# EAGLE schematic board (EAGLE 6.4)
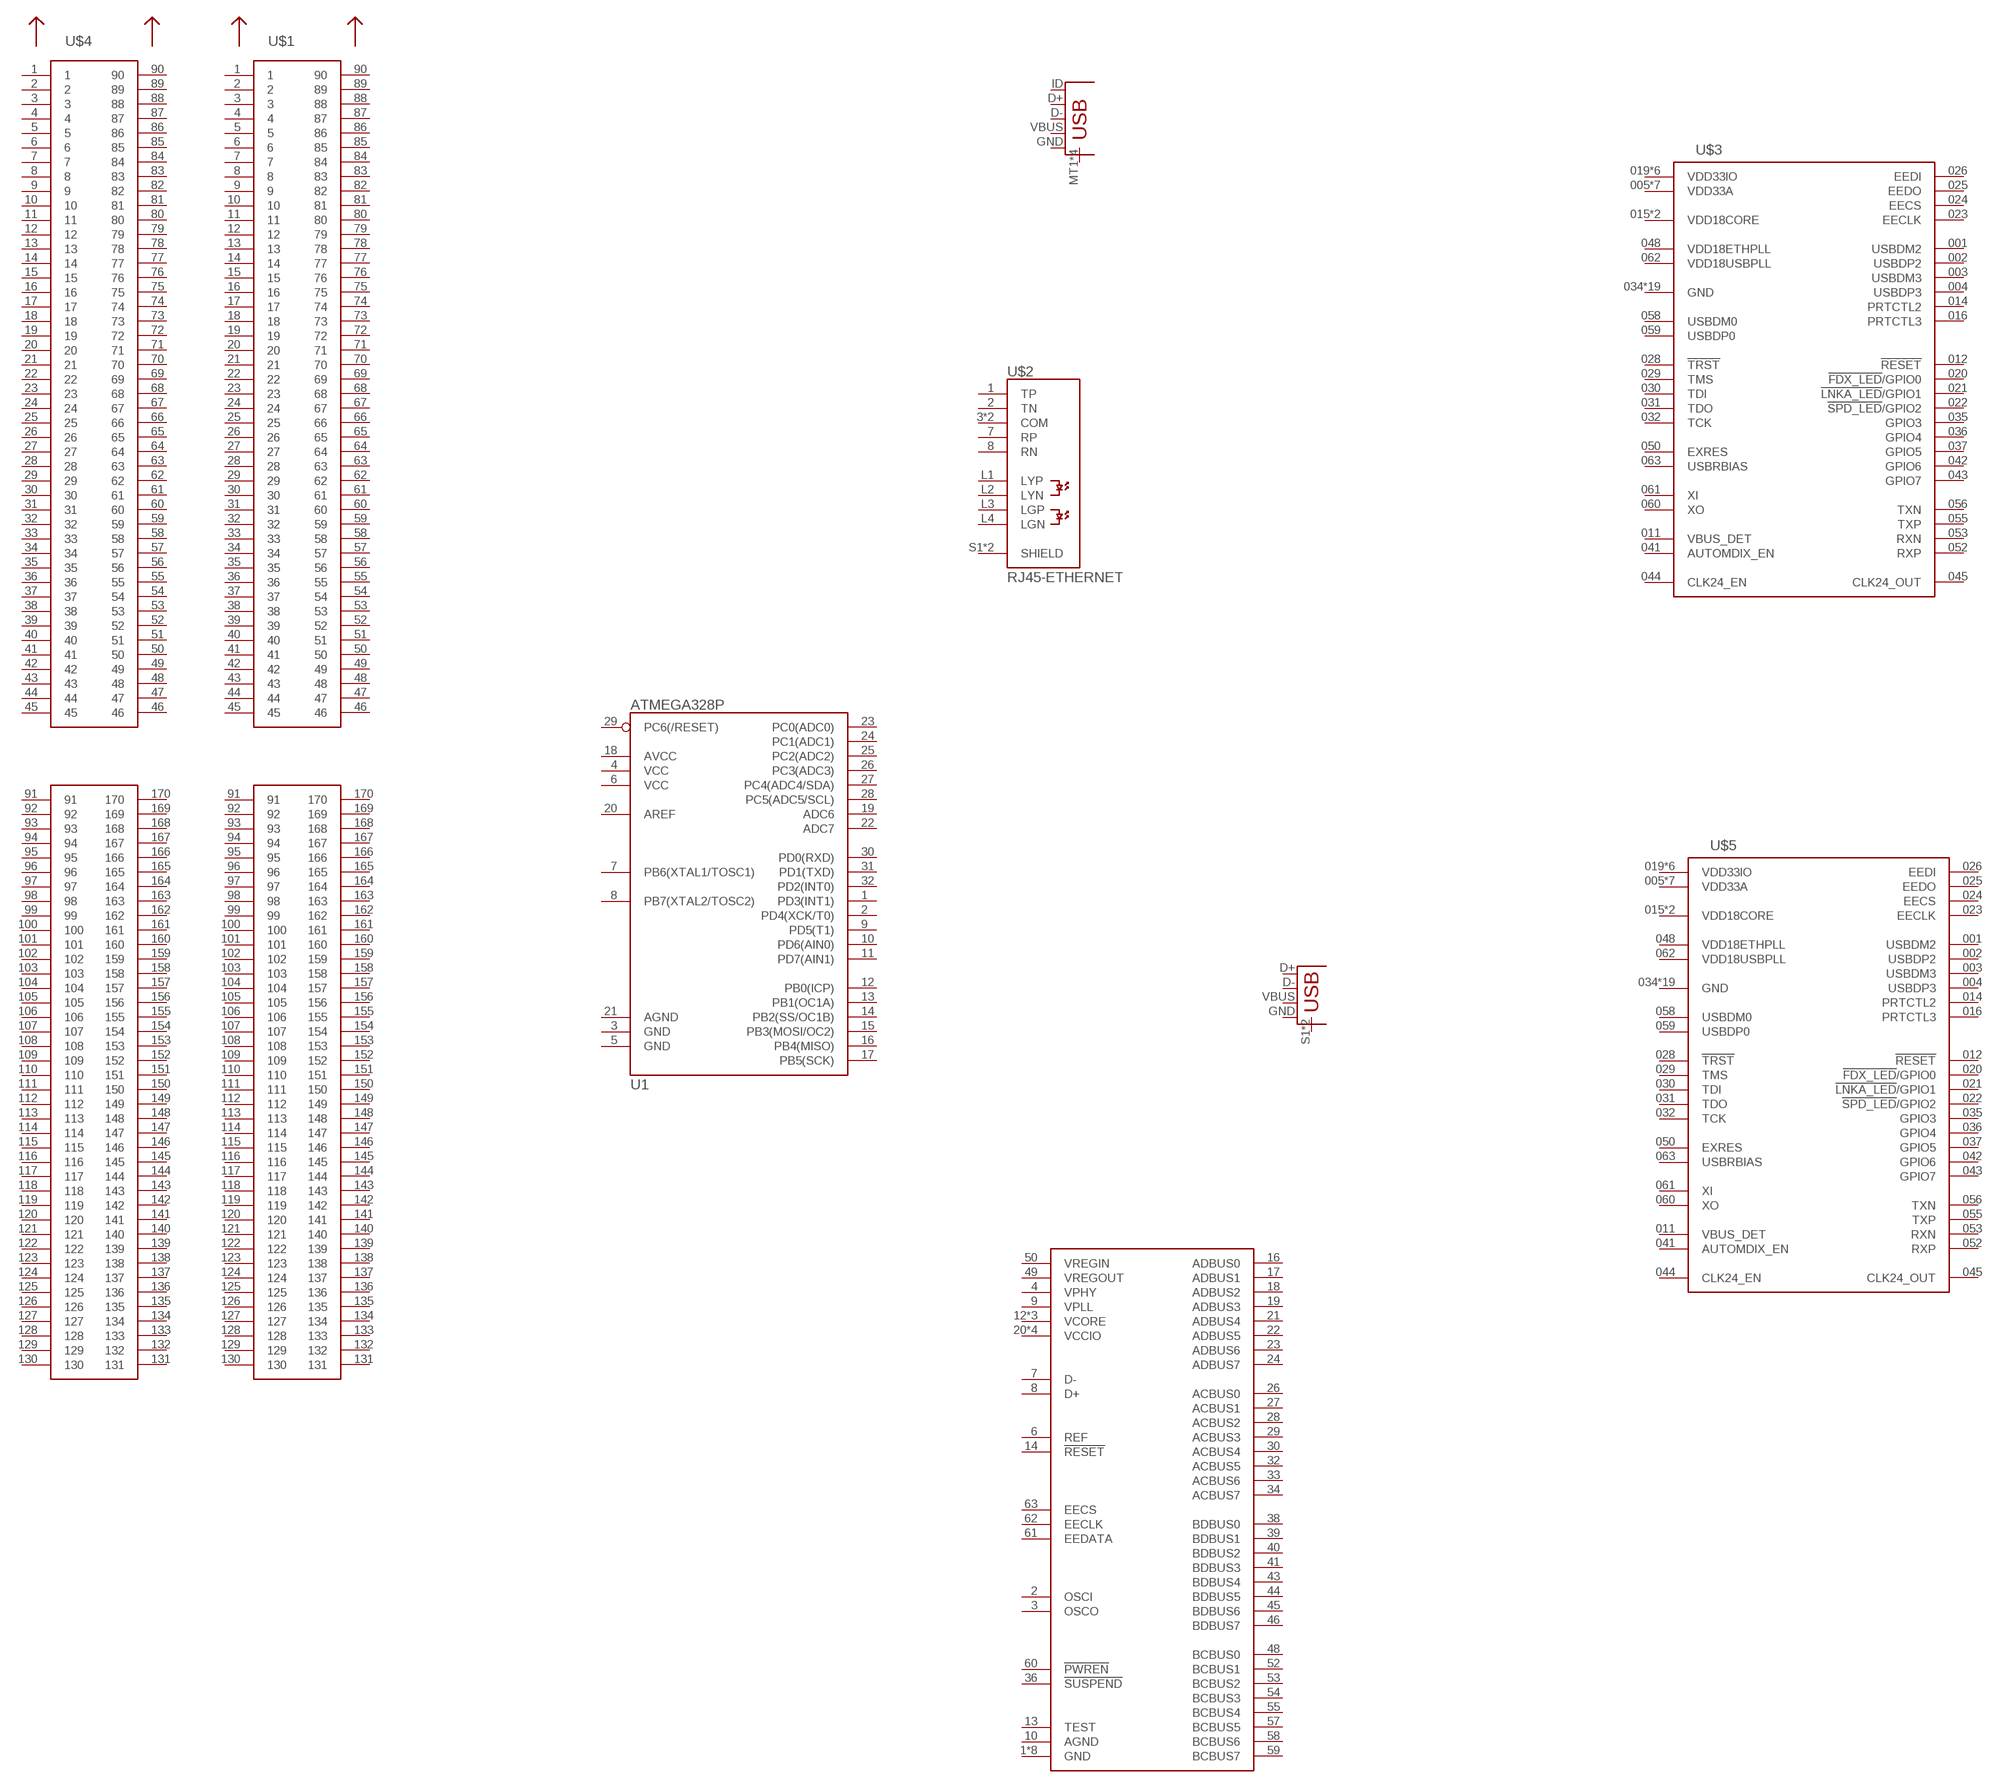
[diagram p0: schematic, sheet 1]

## Parts
IC1  FT2232HL  [TQFP64_LONGPAD]
JP1  USB-IDMICRO  [USB-MICRO]
JP2  USBA-FEMALE-TH  [USB-A-SOCKET-TH]
U1  ATMEGA328P  ATMEGA328_SMT  [TQFP32-08]
U$1  COVEN-IO-V1HDR  [COVEN-IO-V1-HDR]
U$2  RJ45-ETHERNET  [RJ45]
U$3  LAN9512  [QFN64]
U$4  COVEN-IO-V1HDR  [COVEN-IO-V1-HDR]
U$5  LAN9512  [QFN64]
Unconnected: IC1.1(GND) IC1.2(OSCI) IC1.3(OSCO) IC1.4(VPHY) IC1.5(GND) IC1.6(REF) IC1.7(D-) IC1.8(D+) IC1.9(VPLL) IC1.10(AGND) IC1.11(GND) IC1.12(VCORE) IC1.13(TEST) IC1.14(!RESET) IC1.15(GND) IC1.16(ADBUS0) IC1.17(ADBUS1) IC1.18(ADBUS2) IC1.19(ADBUS3) IC1.20(VCCIO) IC1.21(ADBUS4) IC1.22(ADBUS5) IC1.23(ADBUS6) IC1.24(ADBUS7) IC1.25(GND) IC1.26(ACBUS0) IC1.27(ACBUS1) IC1.28(ACBUS2) IC1.29(ACBUS3) IC1.30(ACBUS4) IC1.31(VCCIO) IC1.32(ACBUS5) IC1.33(ACBUS6) IC1.34(ACBUS7) IC1.35(GND) IC1.36(!SUSPEND) IC1.37(VCORE) IC1.38(BDBUS0) IC1.39(BDBUS1) IC1.40(BDBUS2) IC1.41(BDBUS3) IC1.42(VCCIO) IC1.43(BDBUS4) IC1.44(BDBUS5) IC1.45(BDBUS6) IC1.46(BDBUS7) IC1.47(GND) IC1.48(BCBUS0) IC1.49(VREGOUT) IC1.50(VREGIN) IC1.51(GND) IC1.52(BCBUS1) IC1.53(BCBUS2) IC1.54(BCBUS3) IC1.55(BCBUS4) IC1.56(VCCIO) IC1.57(BCBUS5) IC1.58(BCBUS6) IC1.59(BCBUS7) IC1.60(!PWREN) IC1.61(EEDATA) IC1.62(EECLK) IC1.63(EECS) IC1.64(VCORE) JP1.D+ JP1.D- JP1.GND JP1.ID JP1.MT1(SHELL) JP1.MT2(SHELL) JP1.P$1(SHELL) JP1.P$2(SHELL) JP1.VBUS JP2.D+ JP2.D- JP2.GND JP2.S1(SHELL) JP2.S2(SHELL) JP2.VBUS U1.1(PD3(INT1)) U1.2(PD4(XCK/T0)) U1.3(GND) U1.4(VCC) U1.5(GND) U1.6(VCC) U1.7(PB6(XTAL1/TOSC1)) U1.8(PB7(XTAL2/TOSC2)) U1.9(PD5(T1)) U1.10(PD6(AIN0)) U1.11(PD7(AIN1)) U1.12(PB0(ICP)) U1.13(PB1(OC1A)) U1.14(PB2(SS/OC1B)) U1.15(PB3(MOSI/OC2)) U1.16(PB4(MISO)) U1.17(PB5(SCK)) U1.18(AVCC) U1.19(ADC6) U1.20(AREF) U1.21(AGND) U1.22(ADC7) U1.23(PC0(ADC0)) U1.24(PC1(ADC1)) U1.25(PC2(ADC2)) U1.26(PC3(ADC3)) U1.27(PC4(ADC4/SDA)) U1.28(PC5(ADC5/SCL)) U1.29(PC6(/RESET)) U1.30(PD0(RXD)) U1.31(PD1(TXD)) U1.32(PD2(INT0)) U$1.1 U$1.2 U$1.3 U$1.4 U$1.5 U$1.6 U$1.7 U$1.8 U$1.9 U$1.10 U$1.11 U$1.12 U$1.13 U$1.14 U$1.15 U$1.16 U$1.17 U$1.18 U$1.19 U$1.20 U$1.21 U$1.22 U$1.23 U$1.24 U$1.25 U$1.26 U$1.27 U$1.28 U$1.29 U$1.30 U$1.31 U$1.32 U$1.33 U$1.34 U$1.35 U$1.36 U$1.37 U$1.38 U$1.39 U$1.40 U$1.41 U$1.42 U$1.43 U$1.44 U$1.45 U$1.46 U$1.47 U$1.48 U$1.49 U$1.50 U$1.51 U$1.52 U$1.53 U$1.54 U$1.55 U$1.56 U$1.57 U$1.58 U$1.59 U$1.60 U$1.61 U$1.62 U$1.63 U$1.64 U$1.65 U$1.66 U$1.67 U$1.68 U$1.69 U$1.70 U$1.71 U$1.72 U$1.73 U$1.74 U$1.75 U$1.76 U$1.77 U$1.78 U$1.79 U$1.80 U$1.81 U$1.82 U$1.83 U$1.84 U$1.85 U$1.86 U$1.87 U$1.88 U$1.89 U$1.90 U$1.91 U$1.92 U$1.93 U$1.94 U$1.95 U$1.96 U$1.97 U$1.98 U$1.99 U$1.100 U$1.101 U$1.102 U$1.103 U$1.104 U$1.105 U$1.106 U$1.107 U$1.108 U$1.109 U$1.110 U$1.111 U$1.112 U$1.113 U$1.114 U$1.115 U$1.116 U$1.117 U$1.118 U$1.119 U$1.120 U$1.121 U$1.122 U$1.123 U$1.124 U$1.125 U$1.126 U$1.127 U$1.128 U$1.129 U$1.130 U$1.131 U$1.132 U$1.133 U$1.134 U$1.135 U$1.136 U$1.137 U$1.138 U$1.139 U$1.140 U$1.141 U$1.142 U$1.143 U$1.144 U$1.145 U$1.146 U$1.147 U$1.148 U$1.149 U$1.150 U$1.151 U$1.152 U$1.153 U$1.154 U$1.155 U$1.156 U$1.157 U$1.158 U$1.159 U$1.160 U$1.161 U$1.162 U$1.163 U$1.164 U$1.165 U$1.166 U$1.167 U$1.168 U$1.169 U$1.170 U$2.1(TP) U$2.2(TN) U$2.3(COM) U$2.6(COM) U$2.7(RP) U$2.8(RN) U$2.L1(LYP) U$2.L2(LYN) U$2.L3(LGP) U$2.L4(LGN) U$2.S1(SHIELD) U$2.S2(SHIELD) U$3.001(USBDM2) U$3.002(USBDP2) U$3.003(USBDM3) U$3.004(USBDP3) U$3.005(VDD33A) U$3.010(VDD33A) U$3.011(VBUS_DET) U$3.012(!RESET) U$3.014(PRTCTL2) U$3.015(VDD18CORE) U$3.016(PRTCTL3) U$3.019(VDD33IO) U$3.020(!FDX_LED!/GPIO0) U$3.021(!LNKA_LED!/GPIO1) U$3.022(!SPD_LED!/GPIO2) U$3.023(EECLK) U$3.024(EECS) U$3.025(EEDO) U$3.026(EEDI) U$3.027(VDD33IO) U$3.028(!TRST) U$3.029(TMS) U$3.030(TDI) U$3.031(TDO) U$3.032(TCK) U$3.033(VDD33IO) U$3.034(GND) U$3.035(GPIO3) U$3.036(GPIO4) U$3.037(GPIO5) U$3.038(VDD18CORE) U$3.039(VDD33IO) U$3.040(VDD33IO) U$3.041(AUTOMDIX_EN) U$3.042(GPIO6) U$3.043(GPIO7) U$3.044(CLK24_EN) U$3.045(CLK24_OUT) U$3.046(VDD33IO) U$3.048(VDD18ETHPLL) U$3.049(VDD33A) U$3.050(EXRES) U$3.051(VDD33A) U$3.052(RXP) U$3.053(RXN) U$3.054(VDD33A) U$3.055(TXP) U$3.056(TXN) U$3.057(VDD33A) U$3.058(USBDM0) U$3.059(USBDP0) U$3.060(XO) U$3.061(XI) U$3.062(VDD18USBPLL) U$3.063(USBRBIAS) U$3.064(VDD33A) U$3.P$1(GND) U$3.P$2(GND) U$3.P$3(GND) U$3.P$4(GND) U$3.P$5(GND) U$3.P$6(GND) U$3.P$7(GND) U$3.P$8(GND) U$3.P$9(GND) U$3.P$10(GND) U$3.P$11(GND) U$3.P$12(GND) U$3.P$13(GND) U$3.P$14(GND) U$3.P$15(GND) U$3.P$16(GND) U$3.P$17(GND) U$3.PAD(GND) U$4.1 U$4.2 U$4.3 U$4.4 U$4.5 U$4.6 U$4.7 U$4.8 U$4.9 U$4.10 U$4.11 U$4.12 U$4.13 U$4.14 U$4.15 U$4.16 U$4.17 U$4.18 U$4.19 U$4.20 U$4.21 U$4.22 U$4.23 U$4.24 U$4.25 U$4.26 U$4.27 U$4.28 U$4.29 U$4.30 U$4.31 U$4.32 U$4.33 U$4.34 U$4.35 U$4.36 U$4.37 U$4.38 U$4.39 U$4.40 U$4.41 U$4.42 U$4.43 U$4.44 U$4.45 U$4.46 U$4.47 U$4.48 U$4.49 U$4.50 U$4.51 U$4.52 U$4.53 U$4.54 U$4.55 U$4.56 U$4.57 U$4.58 U$4.59 U$4.60 U$4.61 U$4.62 U$4.63 U$4.64 U$4.65 U$4.66 U$4.67 U$4.68 U$4.69 U$4.70 U$4.71 U$4.72 U$4.73 U$4.74 U$4.75 U$4.76 U$4.77 U$4.78 U$4.79 U$4.80 U$4.81 U$4.82 U$4.83 U$4.84 U$4.85 U$4.86 U$4.87 U$4.88 U$4.89 U$4.90 U$4.91 U$4.92 U$4.93 U$4.94 U$4.95 U$4.96 U$4.97 U$4.98 U$4.99 U$4.100 U$4.101 U$4.102 U$4.103 U$4.104 U$4.105 U$4.106 U$4.107 U$4.108 U$4.109 U$4.110 U$4.111 U$4.112 U$4.113 U$4.114 U$4.115 U$4.116 U$4.117 U$4.118 U$4.119 U$4.120 U$4.121 U$4.122 U$4.123 U$4.124 U$4.125 U$4.126 U$4.127 U$4.128 U$4.129 U$4.130 U$4.131 U$4.132 U$4.133 U$4.134 U$4.135 U$4.136 U$4.137 U$4.138 U$4.139 U$4.140 U$4.141 U$4.142 U$4.143 U$4.144 U$4.145 U$4.146 U$4.147 U$4.148 U$4.149 U$4.150 U$4.151 U$4.152 U$4.153 U$4.154 U$4.155 U$4.156 U$4.157 U$4.158 U$4.159 U$4.160 U$4.161 U$4.162 U$4.163 U$4.164 U$4.165 U$4.166 U$4.167 U$4.168 U$4.169 U$4.170 U$5.001(USBDM2) U$5.002(USBDP2) U$5.003(USBDM3) U$5.004(USBDP3) U$5.005(VDD33A) U$5.010(VDD33A) U$5.011(VBUS_DET) U$5.012(!RESET) U$5.014(PRTCTL2) U$5.015(VDD18CORE) U$5.016(PRTCTL3) U$5.019(VDD33IO) U$5.020(!FDX_LED!/GPIO0) U$5.021(!LNKA_LED!/GPIO1) U$5.022(!SPD_LED!/GPIO2) U$5.023(EECLK) U$5.024(EECS) U$5.025(EEDO) U$5.026(EEDI) U$5.027(VDD33IO) U$5.028(!TRST) U$5.029(TMS) U$5.030(TDI) U$5.031(TDO) U$5.032(TCK) U$5.033(VDD33IO) U$5.034(GND) U$5.035(GPIO3) U$5.036(GPIO4) U$5.037(GPIO5) U$5.038(VDD18CORE) U$5.039(VDD33IO) U$5.040(VDD33IO) U$5.041(AUTOMDIX_EN) U$5.042(GPIO6) U$5.043(GPIO7) U$5.044(CLK24_EN) U$5.045(CLK24_OUT) U$5.046(VDD33IO) U$5.048(VDD18ETHPLL) U$5.049(VDD33A) U$5.050(EXRES) U$5.051(VDD33A) U$5.052(RXP) U$5.053(RXN) U$5.054(VDD33A) U$5.055(TXP) U$5.056(TXN) U$5.057(VDD33A) U$5.058(USBDM0) U$5.059(USBDP0) U$5.060(XO) U$5.061(XI) U$5.062(VDD18USBPLL) U$5.063(USBRBIAS) U$5.064(VDD33A) U$5.P$1(GND) U$5.P$2(GND) U$5.P$3(GND) U$5.P$4(GND) U$5.P$5(GND) U$5.P$6(GND) U$5.P$7(GND) U$5.P$8(GND) U$5.P$9(GND) U$5.P$10(GND) U$5.P$11(GND) U$5.P$12(GND) U$5.P$13(GND) U$5.P$14(GND) U$5.P$15(GND) U$5.P$16(GND) U$5.P$17(GND) U$5.PAD(GND)

## Library data of the parts
IC1 = kmod-ics:FT2232H
JP1 = kmod-connectors:USB-ID: USB Connectors Got from SparkFun, removed all but MICROB. Used that successfully. no mounting holes - I think this footprint will work for micro-A/B/AB connectors. haven't tested it yet on anything other than B.; PROD_ID: CONN-09505
JP2 = kmod-connectors:USB: USB Connectors Got from SparkFun, removed all but MICROB. Used that successfully. no mounting holes - I think this footprint will work for micro-A/B/AB connectors. haven't tested it yet on anything other than B.
U1 = SparkFun-DigitalIC:ATMEGA328_SMT: 32-Pin Atmega328 part Commonly used on Arduino compatible boards Available in QFP and QFN packages TQFP is IC-09069 QFN is non-stock; PROD_ID: IC-09069
U$1 U$4 = kmod-connectors:COVEN-IO-V1
U$2 = kmod-connectors:RJ45-ETHERNET
U$3 U$5 = kmod-testing:LAN9512